# EAGLE design rx_board (EAGLE 7.7.0)
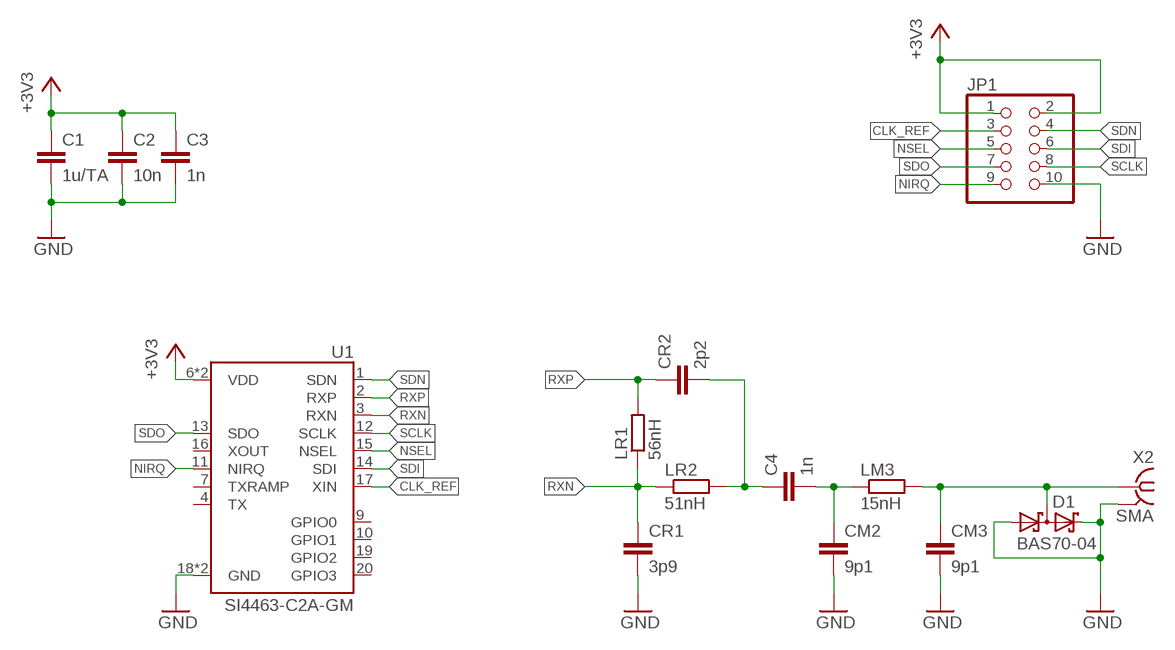
[diagram p0: schematic, sheet 1]

## Parts
C1  1u/TA  C-EUC1206  [C1206]
C2  10n  C-EUC0805  [C0805]
C3  1n  C-EUC0805  [C0805]
C4  1n  C-EUC0805  [C0805]
CM2  9p1  C-EUC0805  [C0805]
CM3  9p1  C-EUC0805  [C0805]
CR1  3p9  C-EUC0805  [C0805]
CR2  2p2  C-EUC0805  [C0805]
D1  BAS70-04  [SOT23]
JP1  PINHD-2X5/90  [2X05/90]
LM3  15nH  R-EU_R0805  [R0805]
LR1  56nH  R-EU_R0805  [R0805]
LR2  51nH  R-EU_R0805  [R0805]
U1  SI4463-C2A-GM  [QFN50P400X400X90-20N]
X2  SMA  SMA-142-0701-871/876  [J502-ND-142-0701-871/876]

## Nets
+3V3 [pwr]: C1.1 C2.1 C3.1 JP1.1 JP1.2 U1.6(VDD) U1.8(VDD)
CLK_REF: JP1.3 U1.17(XIN)
GND [pwr]: C1.2 C2.2 C3.2 CM2.2 CM3.2 CR1.2 D1.1(A1) D1.2(C2) JP1.10 U1.18(GND) U1.21(GND) X2.G@1 X2.G@2 X2.G@3 X2.G@4
N$2: C4.1 CR2.2 LR2.2
N$21 [rf]: CM3.1 D1.3(C1A2) LM3.2 X2.1
N$29: C4.2 CM2.1 LM3.1
NIRQ: JP1.9 U1.11(NIRQ)
NSEL: JP1.5 U1.15(NSEL)
RXN: CR1.1 LR1.1 LR2.1 U1.3(RXN)
RXP: CR2.1 LR1.2 U1.2(RXP)
SCLK: JP1.8 U1.12(SCLK)
SDI: JP1.6 U1.14(SDI)
SDN: JP1.4 U1.1(SDN)
SDO: JP1.7 U1.13(SDO)
Unconnected: U1.4(TX) U1.7(TXRAMP) U1.9(GPIO0) U1.10(GPIO1) U1.16(XOUT) U1.19(GPIO2) U1.20(GPIO3)

## Library data of the parts
C1-C4 CM2 CM3 CR1 CR2 = rcl:C-EU: CAPACITOR, European symbol
D1 = diode:BAS70-04: Silicon Schottky Diodes General-purpose diode for high-speed switching
JP1 = pinhead:PINHD-2X5: PIN HEADER
LM3 LR1 LR2 = resistor:R-EU_: RESISTOR, European symbol
U1 = SI4463-C2A-GM:SI4463-C2A-GM: RF Transceiver FSK/GFSK/GMSK/MSK/OOK 3.3V 20-Pin QFN EP; AVAILABILITY: Unavailable; DESCRIPTION: RF Transceiver FSK/GFSK/GMSK/MSK/OOK 3.3V 20-Pin QFN EP; MF: Silicon Labs; MP: SI4463-C2A-GM; PACKAGE: VFQFN-20 Silicon Labs; PRICE: None
X2 = con-coax:SMA-: SMA 50 Ohm End Launch Jack Receptacle - Round Contact Johnson Components Source: www.johnsoncomponents.com .. J502-ND.pdf; MF: JOHNSON COMPONENTS; MPN: 142-0701-871; OC_FARNELL: 1339835; OC_NEWARK: 91B6105

## Net classes
1 pwr: width 0.5 mm, drill 0.2 mm, clearance 0.127 mm
2 rf: width 0.5 mm, drill 0.2 mm, clearance 0.1 mm

## Board
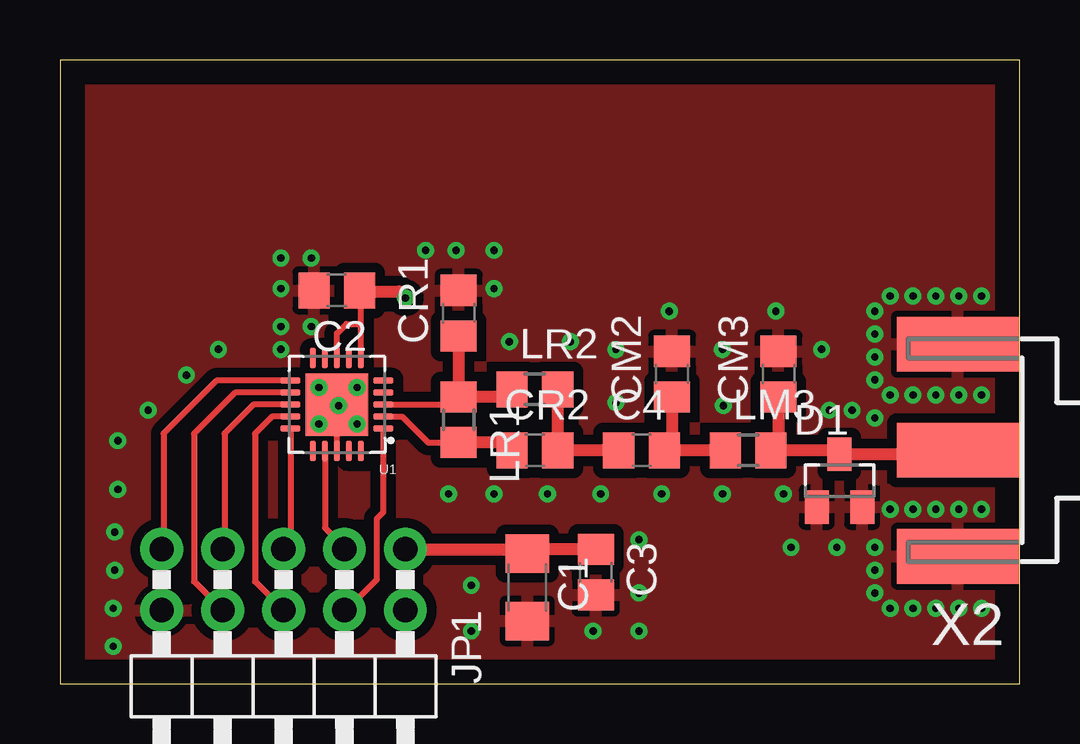
[diagram p1: board, top side]
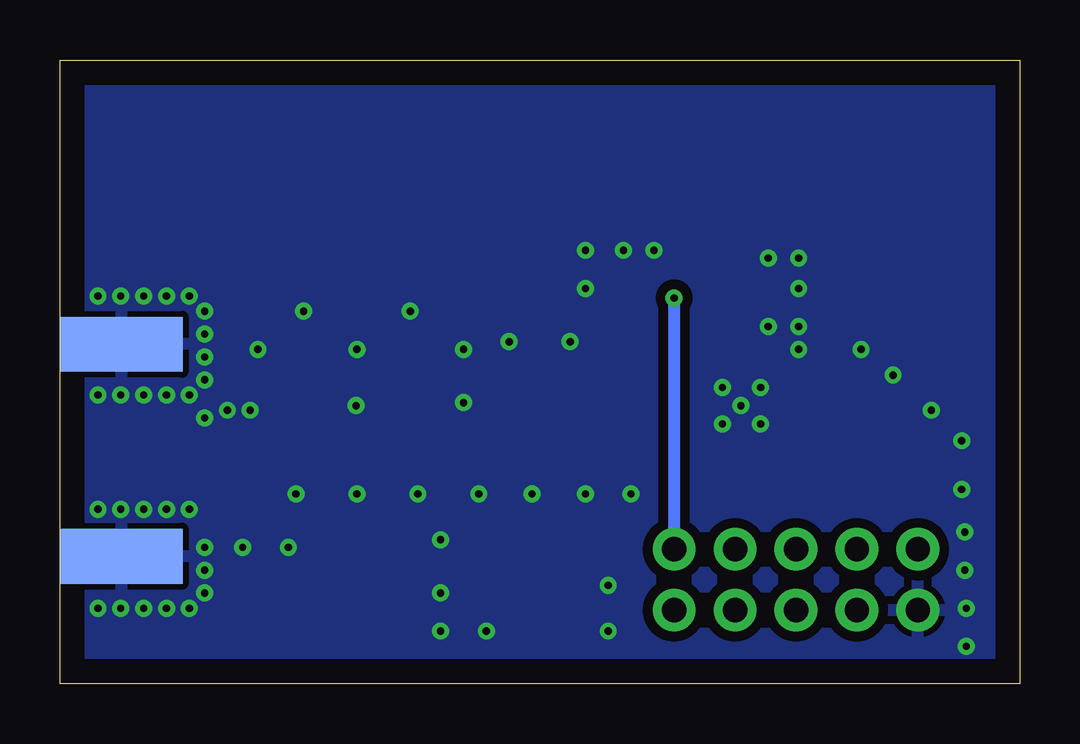
[diagram p2: board, bottom side, seen from below]

Size 40 x 26 mm. Coordinates in mm from the lower left corner, seen from the top.
Outline: 0,26 0,0 40,0 40,26 0,26
Copper layers (1*16): Top 0.035mm / dielectric 1.5mm / Bottom 0.035mm
Design rules "default *": minimum track width 10mil, minimum drill 24mil, track to track 8mil, track to pad 8mil, pad to pad 8mil, via to via 8mil, smd to smd 8mil, copper to edge 40mil, drill to drill 8mil, minimum pad ring 10mil, minimum via ring 8mil, stop-mask expansion 4mil, vias tented up to drill 0.3mm, thermal gap 10mil

### Footprints (pad centres in the part's own frame; a part is rotated, then mirrored left to right if it is on the bottom)
C1206 = smd 1.6 x 1.8: 1 -1.4,0; 2 1.4,0
C0805 = smd 1.3 x 1.5: 1 -0.95,0; 2 0.95,0
SOT23 = smd 1 x 1.4: 1 -0.95,-1.1; 2 0.95,-1.1; 3 0,1.1
2X05/90 = drill 1.016 pad 1.778: 1 -5.08,-6.35; 2 -5.08,-3.81; 3 -2.54,-6.35; 4 -2.54,-3.81; 5 0,-6.35; 6 0,-3.81; 7 2.54,-6.35; 8 2.54,-3.81; 9 5.08,-6.35; 10 5.08,-3.81
R0805 = smd 1.3 x 1.5: 1 -0.95,0; 2 0.95,0
QFN50P400X400X90-20N = smd 0.84 x 0.26: 1 -1.935,1; 2 -1.935,0.5; 3 -1.935,0; 4 -1.935,-0.5; 5 -1.935,-1; 11 1.935,-1; 12 1.935,-0.5; 13 1.935,0; 14 1.935,0.5; 15 1.935,1 | smd 0.26 x 0.84: 6 -1,-1.935; 7 -0.5,-1.935; 8 0,-1.935; 9 0.5,-1.935; 10 1,-1.935; 16 1,1.935; 17 0.5,1.935; 18 0,1.935; 19 -0.5,1.935; 20 -1,1.935 | smd 2.6 x 2.6: 21 0,0
J502-ND-142-0701-871/876 = smd 5.08 x 2.286: 1 2.565,0; G@1 2.565,4.42; G@2 2.565,-4.42 | smd 5.08 x 2.286 bottom: G@3 2.565,4.42; G@4 2.565,-4.42

### Placement (x,y rotation side)
C1  19.48,4.01 270 top
C2  11.54,16.39 180 top
C3  22.34,4.65 270 top
C4  24.24,9.73 0 top
CM2  25.51,12.9 90 top
CM3  29.96,12.9 90 top
CR1  16.62,15.44 90 top
CR2  19.8,9.73 0 top
D1  32.5,8.46 0 top
JP1  9.32,-0.75 180 top
LM3  28.69,9.73 0 top
LR1  16.62,11 270 top
LR2  19.8,12.27 0 top
U1  11.54,11.63 180 top
X2  40,9.73 180 top

### Tracks (layer width: path | path; a pad name or v marks a point on that pad's centre or on a via)
+3V3  (via drill 0.3)
  Top 0.254: U1.6 12.54,15 | 12.54,15 12.54,16.34 C2.1 | U1.8 11.54,14.6 11.94,15 12.54,15
  Top 0.5: C3.1 19.66,5.6 C1.1 19.29,5.6 JP1.1 JP1.2 | 12.54,16.34 14.13,16.34 v14.4,16.08
  Bottom 0.5: v14.4,16.08 JP1.1
CLK_REF
  Top 0.254: U1.17 11.04,6.5 11.68,5.85 11.68,5.78 JP1.3
GND  (via drill 0.3)
  Top 0.254: U1.18 U1.21
  other vias: 9.21,13.93 12.38,12.35 12.38,10.82 10.79,12.35 10.79,10.82 10.48,17.75 9.21,16.47 10.48,14.89 9.21,14.89 9.21,17.75 16.51,18.06 18.1,16.47 18.1,18.06 15.24,18.06 16.19,7.9 18.1,7.9 20.32,7.9 22.54,7.9 25.08,7.9 27.62,7.9 30.16,7.9 29.84,15.52 31.75,13.93 27.62,13.93 25.4,15.52 23.18,13.93 23.18,11.71 21.27,14.25 18.73,14.25 38.42,16.16 37.47,16.16 36.51,16.16 35.56,16.16 34.61,16.16 38.42,12.03 37.47,12.03 36.51,12.03 35.56,12.03 34.61,12.03 33.97,14.57 33.97,13.62 33.97,12.66 33.97,15.52 38.42,7.27 37.47,7.27 36.51,7.27 35.56,7.27 34.61,7.27 33.97,5.68 33.97,4.73 33.97,3.78 34.61,3.14 35.56,3.14 38.42,3.14 37.47,3.14 36.51,3.14 33.97,11.08 33.02,11.39 32.07,11.39 32.38,5.68 30.48,5.68 24.13,3.78 22.23,2.19 24.13,2.19 17.14,4.09 17.14,2.19 2.41,10.12 2.41,8.09 27.66,11.58 2.29,6.32 2.29,4.73 2.22,3.14 2.22,1.55 3.68,11.39 5.27,12.86 6.6,13.93 24.13,6 11.62,11.59
  pour Bottom (isolate 0.406): 40,26 40,0 0,0 0,26
  pour Top (isolate 0.406): 40,26 40,0 0,0 0,26
N$2
  Top 0.5: C4.1 CR2.2 LR2.2
N$21
  Top 0.5: X2.1 37.55,9.56 D1.3 32.5,9.73 LM3.2 29.96,9.73 CM3.1
N$29
  Top 0.5: LM3.1 C4.2 25.51,9.73 CM2.1
NIRQ
  Top 0.254: U1.11 6.52,12.63 4.32,10.43 4.32,5.68 JP1.9
NSEL
  Top 0.254: U1.15 9.61,6.06 9.4,5.85 9.4,5.68 JP1.5
RXN
  Top 0.254: U1.3 16.31,11.63
  Top 0.5: CR1.1 LR1.1 | LR2.1 18.85,11.95 LR1.1 | 16.31,11.63 LR1.1
RXP
  Top 0.254: U1.2 14.27,11.13 15.35,10.05 LR1.2
  Top 0.5: CR2.1 18.85,10.05 LR1.2
SCLK
  Top 0.254: U1.12 7.29,12.13 5.59,10.43 5.59,4.25 JP1.8
SDI
  Top 0.254: U1.14 8.83,11.13 8.13,10.43 8.13,4.25 JP1.6
SDN
  Top 0.254: U1.1 13.48,7.14 13.21,6.87 13.21,4.33 12.45,3.57 12.37,3.57 JP1.4
SDO
  Top 0.254: U1.13 8.06,11.63 6.86,10.43 6.86,5.68 JP1.7

### Text on the board
tDocu: REP_RX_BOARD_1.0